# Altium project Split_Pumps2026.PrjPcb
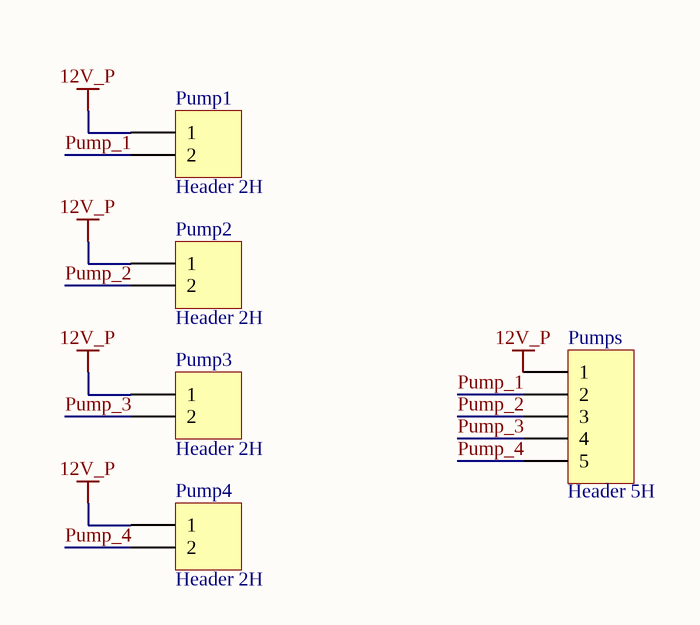
[diagram p0: Split_Pumps.SchDoc]
1 sheet, 5 parts. Net scope: global (net labels, ports and power ports of the same name join across sheets).
Board file: Split_Pumps2026.PcbDoc

## Sheet Split_Pumps.SchDoc
size A4; SheetNumber: 1; SheetTotal: 1

### Parts
Pump1  Header 2H  [S2B-XH-A]
Pump2  Header 2H  [S2B-XH-A]
Pump3  Header 2H  [S2B-XH-A]
Pump4  Header 2H  [S2B-XH-A]
Pumps  Header 5H  [S5B-XH-A]

### Nets
12V_P: Pump1.1 Pump2.1 Pump3.1 Pump4.1 Pumps.1
Pump_1: Pump1.2 Pumps.2
Pump_2: Pump2.2 Pumps.3
Pump_3: Pump3.2 Pumps.4
Pump_4: Pump4.2 Pumps.5

### Library data of the parts
Pump1-Pump4 = Header 2H: Header, 2-Pin, Right Angle; LatestRevisionDate: 17-Jul-2002; LatestRevisionNote: Re-released for DXP Platform.; Publisher: Altium Limited
Pumps = Header 5H: Header, 5-Pin, Right Angle; LatestRevisionDate: 17-Jul-2002; LatestRevisionNote: Re-released for DXP Platform.; Publisher: Altium Limited